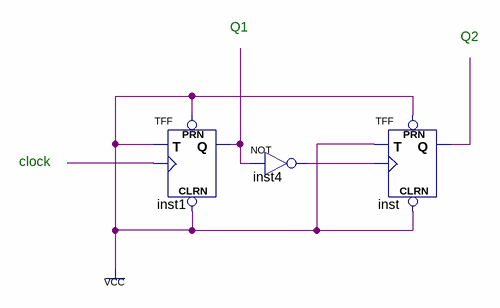
[diagram p0: schematic sheet]
// Quartus schematic 2-bit counter made of 2 T-FF.bdf as structural Verilog: 3 symbols, 0 pins
module \2-bit_counter_made_of_2_T-FF  (
);

  wire inst1_q, inst4_out, inst_q, undriven;

  TFF inst1 (.PRN(1'b1), .CLRN(1'b1), .T(1'b1), .CLK(undriven), .Q(inst1_q));
  not inst4 (inst4_out, inst1_q);
  TFF inst (.PRN(1'b1), .CLRN(1'b1), .T(1'b1), .CLK(inst4_out), .Q(inst_q));

  // Notes on the sheet:
  //   Q1
  //   Q2
  //   clock
endmodule
